# Altium schematic sheet Coordinator6.SchDoc: 协调器6.0
size A2; Author: fagle; DrawnBy: fagle; DocumentNumber: 2; Revision: 6; SheetNumber: 2; SheetTotal: 3
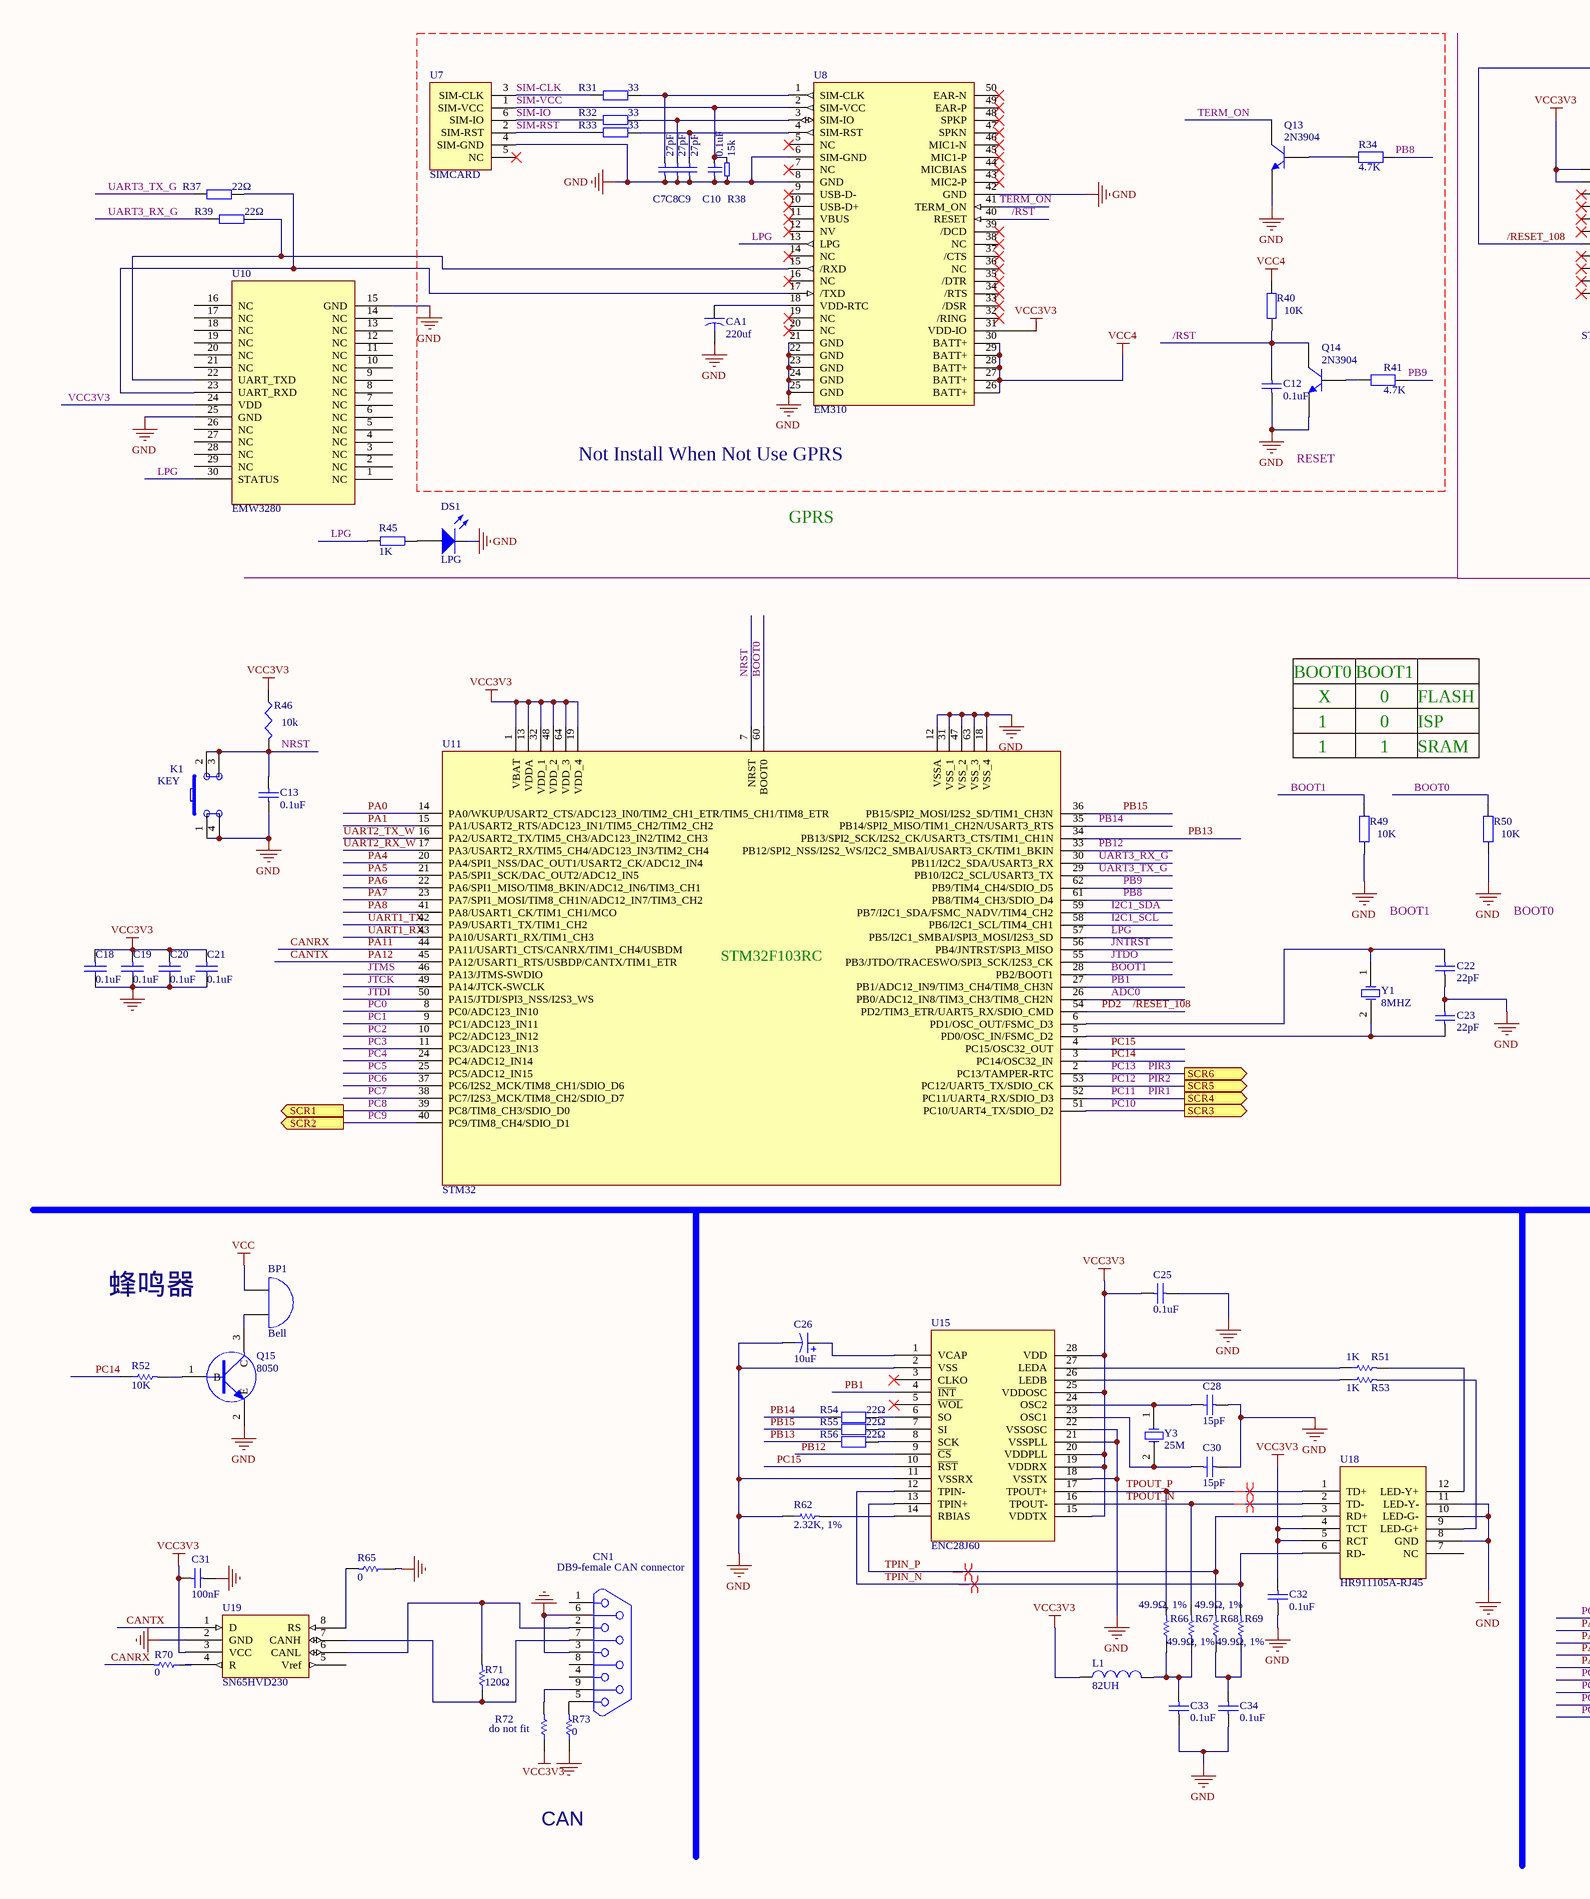
[diagram p0: Coordinator6.SchDoc, left]
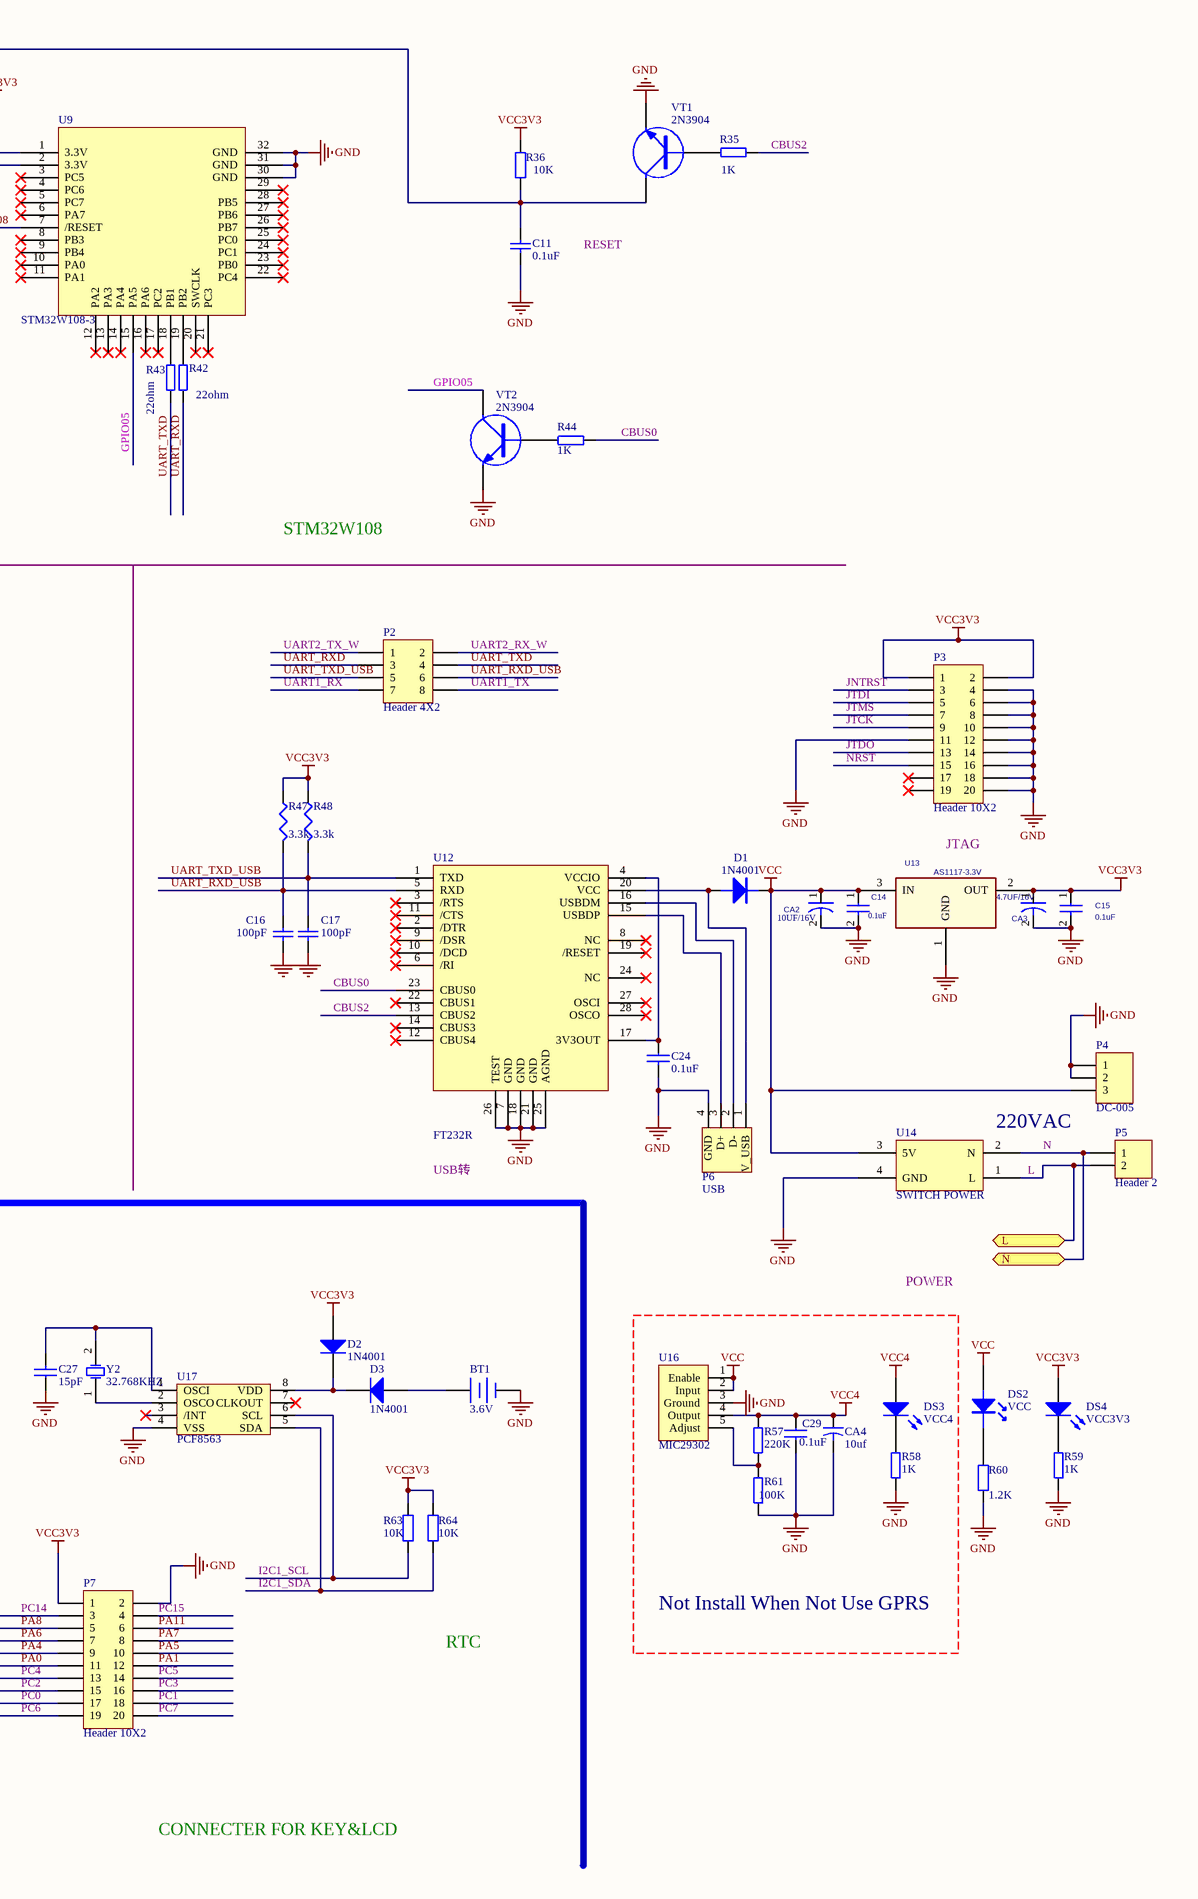
[diagram p1: Coordinator6.SchDoc, right]

## Parts
BP1  Bell  [SPEAK]
BT1  3.6V  [BT]
C7  27pF  [C0805]
C8  27pF  [C0805]
C9  27pF  [C0805]
C10  0.1uF  [C0805]
C11  0.1uF  [C0805]
C12  0.1uF  [C0805]
C13  0.1uF  [C0805]
C14  0.1uF  [C0805]
C15  0.1uF  [C0805]
C16  100pF  [C0805]
C17  100pF  [C0805]
C18  0.1uF  [C0805]
C19  0.1uF  [C0805]
C20  0.1uF  [C0805]
C21  0.1uF  [C0805]
C22  value 22pF  [C0805]  (hidden comment: Cap)
C23  value 22pF  [C0805]  (hidden comment: Cap)
C24  0.1uF  [C0805]
C25  value 0.1uF  [C0805]  (hidden comment: Cap Semi)
C26  value 10uF  [6032-28]  (hidden comment: Cap Pol3)
C27  15pF  [C0805]
C28  value 15pF  [C0805]  (hidden comment: Cap Semi)
C29  0.1uF  [C0805]
C30  value 15pF  [C0805]  (hidden comment: Cap Semi)
C31  100nF  [0805_cap]
C32  value 0.1uF  [C0805]  (hidden comment: Cap Semi)
C33  value 0.1uF  [C0805]  (hidden comment: Cap Semi)
C34  value 0.1uF  [C0805]  (hidden comment: Cap Semi)
CA1  220uf  [6032-28]
CA2  10UF/16V  [6032-28]
CA3  4.7UF/16V  [6032-28]
CA4  10uf  [6032-28]
CN1  DB9-female CAN connector  [CONN_1734348-1]
D1  1N4001  [1210D]
D2  1N4001  [1210D]
D3  1N4001  [1210D]
DS1  LPG  [LED0805]
DS2  VCC  [LED0805]
DS3  VCC4  [LED0805]
DS4  VCC3V3  [LED0805]
K1  KEY  [KEY-DIP]
L1  value 82UH  [6-0805_M]  (hidden comment: Inductor)
P2  Header 4X2  [HDR2X4]
P3  Header 10X2  [IDC-20]
P4  DC-005  [DC-005]
P5  Header 2  [CON2 - 9.6mm]
P6  USB  [USB_B_90D]
P7  Header 10X2  [IDC-20]
Q13  2N3904  [NPN-SOT23]
Q14  2N3904  [NPN-SOT23]
Q15  8050  [SOT23-3]
R31  33  [R0805]
R32  33  [R0805]
R33  33  [R0805]
R34  value 4.7K  [R0805]  (hidden comment: Res2)
R35  1K  [R0805]
R36  value 10K  [R0805]  (hidden comment: Res2)
R37  22Ω  [R0805]
R38  15k  [C0805]
R39  22Ω  [R0805]
R40  value 10K  [R0805]  (hidden comment: Res2)
R41  value 4.7K  [R0805]  (hidden comment: Res2)
R42  22ohm  [R0805]
R43  22ohm  [R0805]
R44  1K  [R0805]
R45  1K  [R0805]
R46  10k  [R0805]
R47  3.3k  [R0805]
R48  3.3k  [R0805]
R49  value 10K  [R0805]  (hidden comment: Res2)
R50  value 10K  [R0805]  (hidden comment: Res2)
R51  value 1K  [R0805]  (hidden comment: Res Semi)
R52  10K  [0805]
R53  value 1K  [R0805]  (hidden comment: Res Semi)
R54  22Ω  [0805]
R55  22Ω  [0805]
R56  22Ω  [0805]
R57  220K  [R0805]
R58  1K  [R0805]
R59  1K  [R0805]
R60  value 1.2K  [R0805]  (hidden comment: Res2)
R61  100K  [R0805]
R62  value 2.32K, 1%  [R0805]  (hidden comment: Res Semi)
R63  value 10K  [R0805]  (hidden comment: Res2)
R64  value 10K  [R0805]  (hidden comment: Res2)
R65  0  [0805]
R66  value 49.9Ω, 1%  [R0805]  (hidden comment: Res Semi)
R67  value 49.9Ω, 1%  [R0805]  (hidden comment: Res Semi)
R68  value 49.9Ω, 1%  [R0805]  (hidden comment: Res Semi)
R69  value 49.9Ω, 1%  [R0805]  (hidden comment: Res Semi)
R70  0  [0805]
R71  120Ω  [0805]
R72  do not fit  [0805]
R73  0  [0805]
U7  SIMCARD  [SIMCARD]
U8  EM310  [EM310]
U9  STM32W108-3  [STM32W108-3]
U10  EMW3280  [EMW-3280]
U11  STM32  [LQFP64]
U12  FT232R  [SSOP-28]
U13  AS1117-3.3V  [SOT-223]
U14  SWITCH POWER  [JY-S13-5V]
U15  ENC28J60  [ENC28J60-ss]
U16  MIC29302  [TO220-5]
U17  PCF8563  [SO-8]
U18  HR911105A-RJ45  [HR911105A]
U19  SN65HVD230  [SO8]
VT1  2N3904  [SOT23-3]
VT2  2N3904  [SOT23-3]
Y1  8MHZ  [XTAL]
Y2  32.768KHZ  [XTAL2]
Y3  25M  [xtal]

## Ports
L (bidir), N (bidir), SCR1 (out), SCR2 (out), SCR3 (out), SCR4 (out), SCR5 (out), SCR6 (out)

## Nets
GND: BT1.2(-) C7.1 C8.1 C9.1 C10.1 C11.1 C12.1 C13.1 C14.2 C15.2 C16.1 C17.1 C18.2 C19.2 C20.2 C21.2 C22.2 C23.1 C24.2 C25.2 C26.2 C27.1 C28.2 C29.2 C30.2 C31.1 C32.2 C33.1 C34.1 CA1.2 CA2.2 CA3.2 CA4.2 CN1.3 CN1.6 DS1.2(K) K1.1 K1.4 P3.4 P3.6 P3.8 P3.10 P3.11 P3.12 P3.14 P3.16 P3.18 P3.20 P4.1 P4.2 P6.4(GND) P7.2 Q13.1(E) Q14.1(E) Q15.2(E) R38.1 R49.1 R50.1 R58.1 R59.1 R60.1 R61.1 R62.1 R65.1 R73.1 U7.4(SIM-GND) U8.6(SIM-GND) U8.8(GND) U8.21(GND) U8.22(GND) U8.23(GND) U8.24(GND) U8.25(GND) U8.42(GND) U9.30(GND) U9.31(GND) U9.32(GND) U10.15(GND) U10.25(GND) U11.12(VSSA) U11.18(VSS_4) U11.31(VSS_1) U11.47(VSS_2) U11.63(VSS_3) U12.7(GND) U12.18(GND) U12.21(GND) U12.25(AGND) U12.26(TEST) U13.1(GND) U14.4(GND) U15.2(VSS) U15.11(VSSRX) U15.18(VSSTX) U15.21(VSSPLL) U15.22(VSSOSC) U16.3(Ground) U17.4(VSS) U18.8(GND) U18.10(LED-G-) U18.11(LED-Y-) U19.2(GND) VT1.2(E) VT2.2(E)
VCC: BP1.1(A) C14.1 CA2.1 D1.2 DS2.1 P4.3 U13.3(IN) U14.3(5V) U16.1(Enable) U16.2(Input)
VCC3V3: C15.1 C18.1 C19.1 C20.1 C21.1 C25.1 C31.2 C32.1 CA3.1 D2.1(A) DS4.1(A) L1.1 P3.1 P3.2 P7.1 R36.2 R46.1 R47.1 R48.1 R63.2 R64.1 R72.1 U8.31(VDD-IO) U9.1(3.3V) U9.2(3.3V) U10.24(VDD) U11.1(VBAT) U11.13(VDDA) U11.19(VDD_4) U11.32(VDD_1) U11.48(VDD_2) U11.64(VDD_3) U13.2(OUT) U15.15(VDDTX) U15.19(VDDRX) U15.20(VDDPLL) U15.25(VDDOSC) U15.28(VDD) U18.4(TCT) U18.5(RCT) U19.3(VCC)
VCC4: C29.1 CA4.1 DS3.1(A) R40.2 R57.2 U8.26(BATT+) U8.27(BATT+) U8.28(BATT+) U8.29(BATT+) U8.30(BATT+) U16.4(Output)
/RESET_108: C11.2 R36.1 U9.7(/RESET) U11.54(PD2/TIM3_ETR/UART5_RX/SDIO_CMD) VT1.3(C)  [also labelled PD2]
/RST: C12.2 Q14.3(C) R40.1 U8.40(RESET)
ADC0: U11.26(PB0/ADC12_IN8/TIM3_CH3/TIM8_CH2N)
BOOT0: R50.2 U11.60(BOOT0)
BOOT1: R49.2 U11.28(PB2/BOOT1)
CANRX: P7.6 R70.2 U11.44(PA11/USART1_CTS/CANRX/TIM1_CH4/USBDM)  [also labelled PA11]
CANTX: U11.45(PA12/USART1_RTS/USBDP/CANTX/TIM1_ETR) U19.1(D)  [also labelled PA12]
CBUS0: R44.2 U12.23(CBUS0)
CBUS2: R35.2 U12.13(CBUS2)
GPIO05: U9.15(PA5) VT2.3(C)
I2C1_SCL: R63.1 U11.58(PB6/I2C1_SCL/TIM4_CH1) U17.6(SCL)
I2C1_SDA: R64.2 U11.59(PB7/I2C1_SDA/FSMC_NADV/TIM4_CH2) U17.5(SDA)
JNTRST: P3.3 U11.56(PB4/JNTRST/SPI3_MISO)
JTCK: P3.9 U11.49(PA14/JTCK-SWCLK)
JTDI: P3.5 U11.50(PA15/JTDI/SPI3_NSS/I2S3_WS)
JTDO: P3.13 U11.55(PB3/JTDO/TRACESWO/SPI3_SCK/I2S3_CK)
JTMS: P3.7 U11.46(PA13/JTMS-SWDIO)
L: P5.2 U14.1(L) ; port L
LPG: R45.2 U8.13(LPG) U10.30(STATUS) U11.57(PB5/I2C1_SMBAI/SPI3_MOSI/I2S3_SD)
N: P5.1 U14.2(N) ; port N
NRST: C13.2 K1.2 K1.3 P3.15 R46.2 U11.7(NRST)
PA0: P7.11 U11.14(PA0/WKUP/USART2_CTS/ADC123_IN0/TIM2_CH1_ETR/TIM5_CH1/TIM8_ETR)
PA1: P7.12 U11.15(PA1/USART2_RTS/ADC123_IN1/TIM5_CH2/TIM2_CH2)
PA4: P7.9 U11.20(PA4/SPI1_NSS/DAC_OUT1/USART2_CK/ADC12_IN4)
PA5: P7.10 U11.21(PA5/SPI1_SCK/DAC_OUT2/ADC12_IN5)
PA6: P7.7 U11.22(PA6/SPI1_MISO/TIM8_BKIN/ADC12_IN6/TIM3_CH1)
PA7: P7.8 U11.23(PA7/SPI1_MOSI/TIM8_CH1N/ADC12_IN7/TIM3_CH2)
PA8: P7.5 U11.41(PA8/USART1_CK/TIM1_CH1/MCO)
PB1: U11.27(PB1/ADC12_IN9/TIM3_CH4/TIM8_CH3N) U15.4(~{INT})
PB8: R34.2 U11.61(PB8/TIM4_CH3/SDIO_D4)
PB9: R41.2 U11.62(PB9/TIM4_CH4/SDIO_D5)
PB12: U11.33(PB12/SPI2_NSS/I2S2_WS/I2C2_SMBAI/USART3_CK/TIM1_BKIN) U15.9(~{CS})
PB13: R56.1 U11.34(PB13/SPI2_SCK/I2S2_CK/USART3_CTS/TIM1_CH1N)
PB14: R54.1 U11.35(PB14/SPI2_MISO/TIM1_CH2N/USART3_RTS)
PB15: R55.1 U11.36(PB15/SPI2_MOSI/I2S2_SD/TIM1_CH3N)
PC0: P7.17 U11.8(PC0/ADC123_IN10)
PC1: P7.18 U11.9(PC1/ADC123_IN11)
PC2: P7.15 U11.10(PC2/ADC123_IN12)
PC3: P7.16 U11.11(PC3/ADC123_IN13)
PC4: P7.13 U11.24(PC4/ADC12_IN14)
PC5: P7.14 U11.25(PC5/ADC12_IN15)
PC6: P7.19 U11.37(PC6/I2S2_MCK/TIM8_CH1/SDIO_D6)
PC7: P7.20 U11.38(PC7/I2S3_MCK/TIM8_CH2/SDIO_D7)
PC8: U11.39(PC8/TIM8_CH3/SDIO_D0) ; port SCR1
PC9: U11.40(PC9/TIM8_CH4/SDIO_D1) ; port SCR2
PC10: U11.51(PC10/UART4_TX/SDIO_D2) ; port SCR3
PC11: U11.52(PC11/UART4_RX/SDIO_D3) ; port SCR4  [also labelled PIR1]
PC12: U11.53(PC12/UART5_TX/SDIO_CK) ; port SCR5  [also labelled PIR2]
PC13: U11.2(PC13/TAMPER-RTC) ; port SCR6  [also labelled PIR3]
PC14: P7.3 R52.1 U11.3(PC14/OSC32_IN)
PC15: P7.4 U11.4(PC15/OSC32_OUT) U15.10(~{RST})
SIM-CLK: R31.1 U7.3(SIM-CLK)
SIM-IO: R32.1 U7.6(SIM-IO)
SIM-RST: R33.1 U7.2(SIM-RST)
SIM-VCC: C10.2 R38.2 U7.1(SIM-VCC) U8.2(SIM-VCC)
TERM_ON: Q13.3(C) U8.41(TERM_ON)
TPIN_N: R69.2 U15.12(TPIN-) U18.6(RD-)
TPIN_P: R68.2 U15.13(TPIN+) U18.3(RD+)
TPOUT_N: R67.2 U15.16(TPOUT-) U18.2(TD-)
TPOUT_P: R66.2 U15.17(TPOUT+) U18.1(TD+)
UART1_RX: P2.7 U11.43(PA10/USART1_RX/TIM1_CH3)
UART1_TX: P2.8 U11.42(PA9/USART1_TX/TIM1_CH2)
UART2_RX_W: P2.2 U11.17(PA3/USART2_RX/TIM5_CH4/ADC123_IN3/TIM2_CH4)
UART2_TX_W: P2.1 U11.16(PA2/USART2_TX/TIM5_CH3/ADC123_IN2/TIM2_CH3)
UART3_RX_G: R39.1 U11.30(PB11/I2C2_SDA/USART3_RX)
UART3_TX_G: R37.1 U11.29(PB10/I2C2_SCL/USART3_TX)
UART_RXD: P2.3 R42.1
UART_RXD_USB: C16.2 P2.6 R47.2 U12.5(RXD)
UART_TXD: P2.4 R43.1
UART_TXD_USB: C17.2 P2.5 R48.2 U12.1(TXD)
NetBP1_2: BP1.2(B) Q15.3(C)
NetBT1_1: BT1.1(+) D3.1(A)
NetC7_2: C7.2 R31.2 U8.1(SIM-CLK)
NetC8_2: C8.2 R32.2 U8.3(SIM-IO)
NetC9_2: C9.2 R33.2 U8.4(SIM-RST)
NetC22_1: C22.1 U11.6(PD1/OSC_OUT/FSMC_D3) Y1.1(OSC1)
NetC23_2: C23.2 U11.5(PD0/OSC_IN/FSMC_D2) Y1.2(OSC2)
NetC24_1: C24.1 U12.4(VCCIO) U12.17(3V3OUT)
NetC26_1: C26.1 U15.1(VCAP)
NetC27_2: C27.2 U17.1(OSCI) Y2.2(OSC2)
NetC28_1: C28.1 U15.24(OSC2) Y3.1(OSC1)
NetC30_1: C30.1 U15.23(OSC1) Y3.2(OSC2)
NetC33_2: C33.2 L1.2 R66.1 R67.1
NetC34_2: C34.2 R68.1 R69.1
NetCA1_1: CA1.1 U8.18(VDD-RTC)
NetCN1_2: CN1.2 R71.2 U19.6(CANL)
NetCN1_5: CN1.5 R73.2
NetCN1_7: CN1.7 R71.1 U19.7(CANH)
NetCN1_9: CN1.9 R72.2
NetD1_1: D1.1 P6.1(V_USB) U12.20(VCC)
NetD2_2: D2.2(K) D3.2(K) U17.8(VDD)
NetDS1_1: DS1.1(A) R45.1
NetDS2_2: DS2.2 R60.2
NetDS3_2: DS3.2(K) R58.2
NetDS4_2: DS4.2(K) R59.2
NetP6_2: P6.2(D-) U12.16(USBDM)
NetP6_3: P6.3(D+) U12.15(USBDP)
NetQ13_2: Q13.2(B) R34.1
NetQ14_2: Q14.2(B) R41.1
NetQ15_1: Q15.1(B) R52.2
NetR35_1: R35.1 VT1.1(B)
NetR37_2: R37.2 U8.17(/TXD) U10.23(UART_RXD)
NetR39_2: R39.2 U8.15(/RXD) U10.22(UART_TXD)
NetR42_2: R42.2 U9.19(PB2)
NetR43_2: R43.2 U9.18(PB1)
NetR44_1: R44.1 VT2.1(B)
NetR51_1: R51.1 U15.27(LEDA)
NetR51_2: R51.2 U18.12(LED-Y+)
NetR53_1: R53.1 U15.26(LEDB)
NetR53_2: R53.2 U18.9(LED-G+)
NetR54_2: R54.2 U15.6(SO)
NetR55_2: R55.2 U15.7(SI)
NetR56_2: R56.2 U15.8(SCK)
NetR57_1: R57.1 R61.2 U16.5(Adjust)
NetR62_2: R62.2 U15.14(RBIAS)
NetR65_2: R65.2 U19.8(RS)
NetR70_1: R70.1 U19.4(R)
NetU17_2: U17.2(OSCO) Y2.1(OSC1)

Not connected (* = marked no-connect by the designer): CN1 1 4 8; P3 17* 19*; U7 5(NC)*; U8 5(NC)* 7(NC)* 9(USB-D-)* 10(USB-D+)* 11(VBUS)* 12(NV)* 14(NC)* 16(NC)* 19(NC)* 20(NC)* 32(/RING)* 33(/DSR)* 34(/RTS)* 35(/DTR)* 36(NC)* 37(/CTS)* 38(NC)* 39(/DCD)* 43(MIC2-P)* 44(MICBIAS)* 45(MIC1-P)* 46(MIC1-N)* 47(SPKN)* 48(SPKP)* 49(EAR-P)* 50(EAR-N)*; U9 3(PC5)* 4(PC6)* 5(PC7)* 6(PA7)* 8(PB3)* 9(PB4)* 10(PA0)* 11(PA1)* 12(PA2)* 13(PA3)* 14(PA4)* 16(PA6)* 17(PC2)* 20(SWCLK)* 21(PC3)* 22(PC4)* 23(PB0)* 24(PC1)* 25(PC0)* 26(PB7)* 27(PB6)* 28(PB5)* 29*; U10 1(NC) 2(NC) 3(NC) 4(NC) 5(NC) 6(NC) 7(NC) 8(NC) 9(NC) 10(NC) 11(NC) 12(NC) 13(NC) 14(NC) 16(NC) 17(NC) 18(NC) 19(NC) 20(NC) 21(NC) 26(NC) 27(NC) 28(NC) 29(NC); U12 2(/DTR)* 3(/RTS)* 6(/RI)* 8(NC)* 9(/DSR)* 10(/DCD)* 11(/CTS)* 12(CBUS4)* 14(CBUS3)* 19(/RESET)* 22(CBUS1)* 24(NC)* 27(OSCI)* 28(OSCO)*; U15 3(CLKO)* 5(~{WOL})*; U17 3(/INT)* 7(CLKOUT)*; U18 7(NC); U19 5(Vref)

## Layout directives
differential pair: TPIN_N, TPIN_P, TPOUT_N, TPOUT_P

## Notes on the sheet
- RESET
- Not Install When Not Use GPRS
- GPRS
- STM32W108
- BOOT0
- BOOT1
- X
- 1
- 0
- FLASH
- ISP
- SRAM
- JTAG
- USB转
- (near U14) 220VAC
- 蜂鸣器
- POWER
- RTC
- CAN
- CONNECTER FOR KEY&LCD
- (in symbol STM32F103RE) STM32F103RC

## Library data of the parts
BP1 = Bell: Electrical Bell; Published: 24-Mar-1999; LatestRevisionDate: 17-Jul-2002; LatestRevisionNote: Re-released for DXP Platform.; PackageReference: PIN2; Publisher: Altium Limited
BT1 = Battery: Multicell Battery; Published: 24-Mar-1999; LatestRevisionDate: 17-Jul-2002; LatestRevisionNote: Re-released for DXP Platform.; PackageReference: BAT-2; Publisher: Altium Limited
C7-C10 = Cap
C11-C13 = Cap: Capacitor; Value: 100pF; Published: 8-Jun-2000; LatestRevisionDate: 17-Jul-2002; LatestRevisionNote: Re-released for DXP Platform.; Publisher: Altium Limited
C14 C15 = C
C16 C17 C22 C23 = Cap: Capacitor; Published: 8-Jun-2000; LatestRevisionDate: 17-Jul-2002; LatestRevisionNote: Re-released for DXP Platform.; Publisher: Altium Limited
  C16 C17: Value: 100pF
  C22 C23: PackageReference: RAD-0.3
C18-C21 C31 = CAP: Capacitor
  C31: Published: 8-Jun-2000; Revision: July-2002: Re-released for DXP Platform.; Publisher: Altium Limited; Value: 100nF
C24 C27 C29 = C: Right: 20; Bottom: 10
C25 C28 C30 C32-C34 = Cap Semi: Capacitor (Semiconductor SIM Model); Published: 8-Jun-2000; LatestRevisionDate: 29-May-2009; LatestRevisionNote: IPC-7351 Footprint Added.; PackageReference: C1206; Publisher: Altium Limited; PackageDescription: Chip Capacitor
C26 = Cap Pol3: Polarized Capacitor (Surface Mount); Published: 8-Jun-2000; LatestRevisionDate: 29-May-2009; LatestRevisionNote: IPC-7351 Footprint Added.; PackageReference: C0805; Publisher: Altium Limited; PackageDescription: Chip Capacitor
CA1 CA4 = Cap2
CA2 CA3 = ECAP
CN1 = DB9
D1 = DIODE
D2 D3 = Diode 1N4001: 1 Amp General Purpose Rectifier; Published: 8-Jun-2000; LatestRevisionDate: 17-Jul-2002; LatestRevisionNote: Re-released for DXP Platform.; DatasheetDocument: 1998; PackageDocument: Aug-1999; PackageReference: DO-41; Publisher: Altium Limited; Code_JEDEC: DO-204-AL; ComponentLink1Description: Manufacturer Link; ComponentLink1URL: http://www.fairchildsemi.com/; ComponentLink2Description: Datasheet; ComponentLink2URL: http://www.fairchildsemi.com/ds/1N%2F1N4001.pdf
DS1 DS3 DS4 = LED3: Typical BLUE SiC LED; Published: 8-Jun-2000; LatestRevisionDate: 17-Dec-2003; LatestRevisionNote: PCB Footprint replaced.; Publisher: Altium Limited
DS2 = LED
L1 = Inductor: Code_IEC: 1005; Published: 8-Jun-2000; LatestRevisionDate: 29-May-2009; LatestRevisionNote: IPC-7351 Footprint Added.; PackageReference: 0402-A; Publisher: Altium Limited; PackageDescription: Chip Inductor; Code_JEITA: 0402
P2 = Header 4X2: Header, 4-Pin, Dual row; LatestRevisionDate: 17-Jul-2002; LatestRevisionNote: Re-released for DXP Platform.; Publisher: Altium Limited
P3 P7 = Header 10X2: Header, 10-Pin, Dual row; LatestRevisionDate: 17-Jul-2002; LatestRevisionNote: Re-released for DXP Platform.; Publisher: Altium Limited
P4 = Header 3: Header, 3-Pin; LatestRevisionDate: 17-Jul-2002; LatestRevisionNote: Re-released for DXP Platform.; Publisher: Altium Limited
P5 = Header 2: Header, 2-Pin; LatestRevisionDate: 17-Jul-2002; LatestRevisionNote: Re-released for DXP Platform.; Publisher: Altium Limited
Q13 Q14 = 2N3904: NPN General Purpose Amplifier; Published: 8-Jun-2000; LatestRevisionDate: 15-Jan-2003; LatestRevisionNote: PCB Footprint 'BCY-W3/D4.7' replaced; DatasheetDocument: 1997; PackageDocument: Sep-1998; PackageReference: TO-92A; Publisher: Altium Limited; Code_JEDEC: TO-92A; ComponentLink1Description: Manufacturer Link; ComponentLink1URL: http://www.fairchildsemi.com/; ComponentLink2Description: Datasheet; ComponentLink2URL: http://www.fairchildsemi.com/ds/2N%2F2N3904.pdf
Q15 VT1 VT2 = NPN: NPN Transistor
R31-R33 R35 R37 R39 R42-R45 R57-R59 R61 = RES: R
R34 R36 R40 R41 R49 R50 R60 R63 R64 = Res2: Resistor; Published: 8-Jun-2000; LatestRevisionDate: 17-Jul-2002; LatestRevisionNote: Re-released for DXP Platform.; PackageReference: AXIAL-0.4; Publisher: Altium Limited
R38 = Res2
R46-R48 = Res3: Resistor; Value: 1K; Published: 8-Jun-2000; LatestRevisionDate: 17-Jul-2002; LatestRevisionNote: Re-released for DXP Platform.; Publisher: Altium Limited
R51 R53 R62 R66-R69 = Res Semi: Semiconductor Resistor; Published: 8-Jun-2000; LatestRevisionDate: 17-Jul-2002; LatestRevisionNote: Re-released for DXP Platform.; PackageReference: AXIAL-0.5; Publisher: Altium Limited
R52 = RES: Resistor; Value: 1K; Published: 8-Jun-2000; Revision: July-2002: Re-released for DXP Platform.; Publisher: Altium Limited
R54-R56 = Res2: Resistor; Value: 1K; Published: 8-Jun-2000; LatestRevisionDate: 17-Jul-2002; LatestRevisionNote: Re-released for DXP Platform.; PackageReference: AXIAL-0.4; Publisher: Altium Limited; PackageDescription: Axial Device, Thru-Hole; 2 Leads; 0.4 in Pin Spacing
R65 R71-R73 = res1: Resistor; Value: 1K; Published: 8-Jun-2000; Revision: July-2002: Re-released for DXP Platform.; Publisher: Altium Limited
R70 = Res1: Resistor; Value: 1K; Published: 8-Jun-2000; Revision: July-2002: Re-released for DXP Platform.; Publisher: Altium Limited
U7 = SIM
U8 = EM310: GSM
U11 = STM32F103RE
U13 = AS1117
U14 = SW_PW_220TO5V: Power5V
U19 = SN65HVD230D
Y1-Y3 = XTAL: Crystal Oscillator; Published: 8-Jun-2000; LatestRevisionDate: 17-Jul-2002; LatestRevisionNote: Re-released for DXP Platform.; PackageReference: R38; Publisher: Altium Limited